# Altium project LimeKEY-RPCM_1v1.PrjPcb (part 11 of 12)
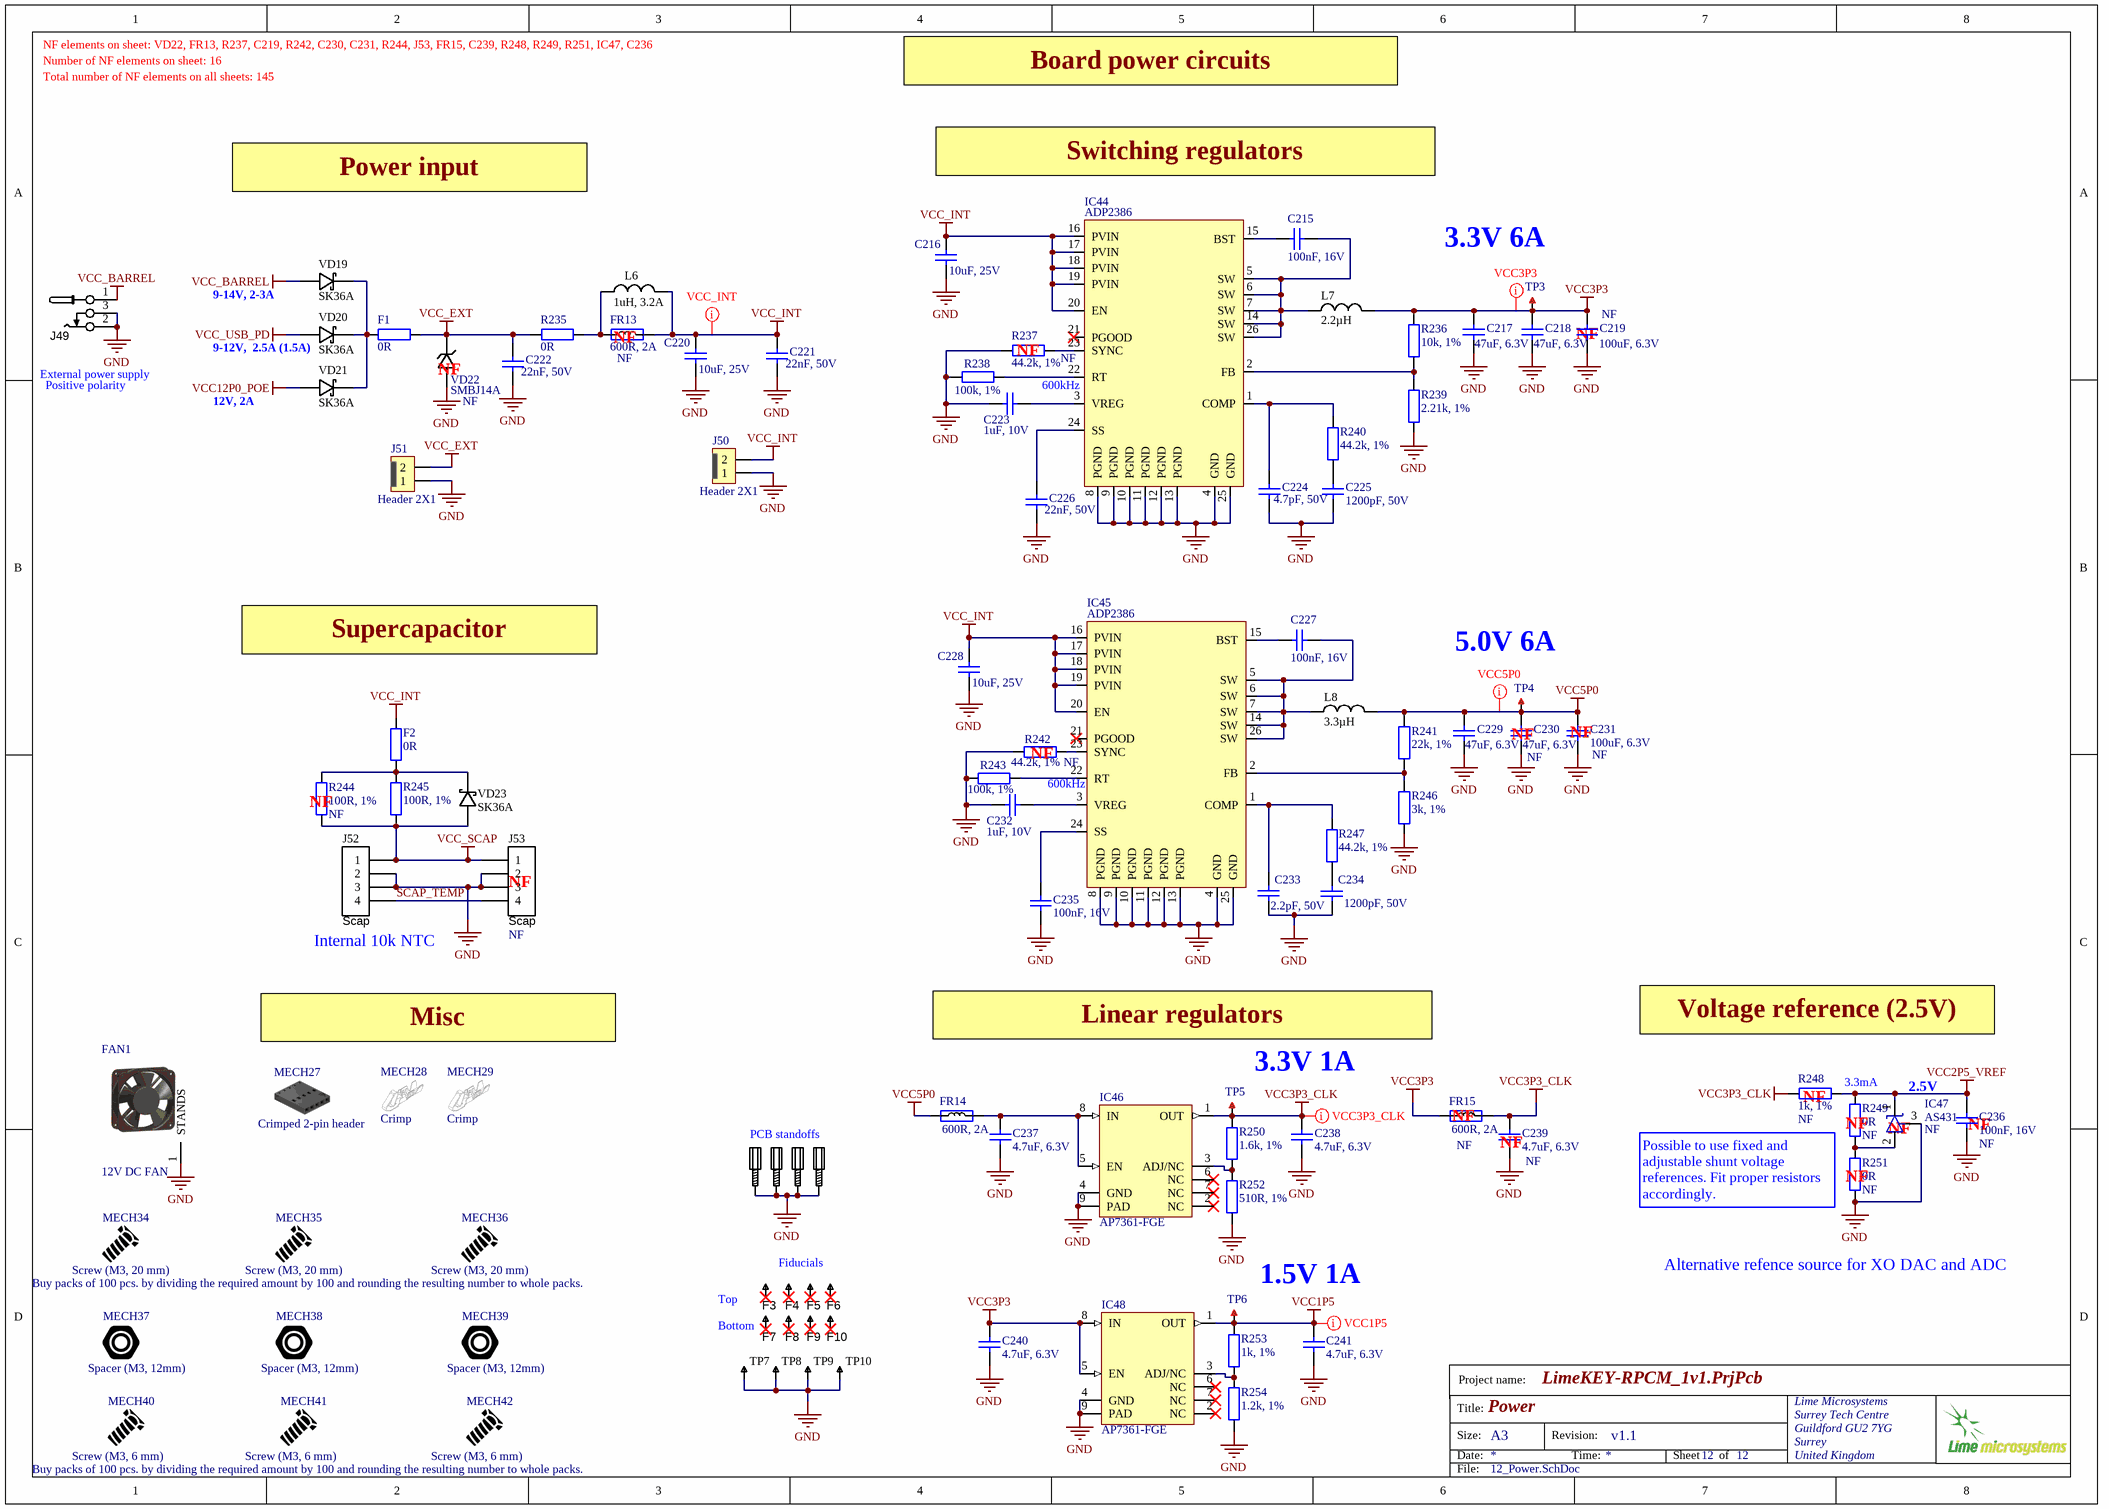
[diagram p111: 12_Power.SchDoc]

## Sheet 12_Power.SchDoc: Power (continued)

### Library data of the parts
C215 C227 C235 = Cap_0402: Manufacturer: Murata Electronics; Manufacturer Part Number 1: GRM155R71C104KA88D; Part Description: 0.10µF ±10% 16V Ceramic Capacitor X7R 0402 (1005 Metric); Tolerance: 10 %; Type: General Purpose MLCC; Capacitance: 0.1 uF; Case Length: 1 mm; Dielectric: X7R; Case Height: 0.5 mm; Temperature Coefficient / Code: +/- 15 %; Value: 100nF, 16V; Supplier 1: Mouser; Supplier Part Number 1: 81-GRM155R71C104KA88; Case Code - in: 0402; RoHS: RoHS Compliant; Operating Temperature Range: - 55 C to + 125 C; Series: GRM; Termination Style: SMD/SMT; Package / Case: 0402 (1005 metric); Voltage Rating DC: 16 V; Maximum Operating Temperature: + 125 C; Case Code - mm: 1005; Minimum Operating Temperature: - 55 C; Product Category: Low & Medium Capacitance SMD Ceramic Chip Capacitors; Packaging: Reel; Product: General Type MLCCs; Category: Multilayer Ceramic Capacitors MLCC - SMD/SMT; Brand: Murata Electronics; Case Width: 0.5 mm; RoHS - Mouser: Y; Standard Pack Qty: 10000; Minimum Order Quantity: 1; Reeling: True; Manufacturer Part Number: GRM155R71C104KA88D
C216 C220 C228 = Cap_0603: Manufacturer: Murata Electronics North America; Manufacturer Part Number: GRM188R61E106MA73D; Part Description: 10µF ±20% 25V X5R Ceramic Capacitor -55°C ~ 85°C Surface Mount, MLCC 0603 (1608 Metric) 0.063" L x 0.031" W (1.60mm x 0.80mm); Capacitance: 10µF; Tolerance: ±20%; Temperature Coefficient: X5R; Supplier 1: Digi-Key; Supplier Part Number 1: 490-7202-2-ND; Category: Capacitors; RoHS: RoHS Compliant; Packaging: Tape & Reel (TR); Voltage - Rated: 25V; Mounting Type: Surface Mount, MLCC; Operating Temperature: -55°C ~ 85°C; Applications: General Purpose; Ratings: -; Package / Case: 0603 (1608 Metric); Size / Dimension: 0.063" L x 0.031" W (1.60mm x 0.80mm); Height - Seated (Max): -; Thickness (Max): 0.031" (0.80mm); Lead Spacing: -; Features: -; Lead Style: -; value: 10uF, 25V; Manufacturer Part Number 1: GRM188R61E106MA73D
C217 C218 C229 C230 = Cap_1206: Manufacturer: Samsung Electro-Mechanics; Manufacturer Part Number: CL31A476MQHNNNE; Part Description: 47µF ±20% 6.3V Ceramic Capacitor X5R 1206 (3216 Metric); Notification: Current market demand for these product types have resulted in fluctuating and extending lead times. Lead times may differ.; Temperature Coefficient: X5R; Tolerance: ±20%; Thickness (Max): 0.071" (1.80mm); Height - Seated (Max): -; Operating Temperature: -55°C ~ 85°C; Lead Style: -; Package / Case: 1206 (3216 Metric); Size / Dimension: 0.126" L x 0.063" W (3.20mm x 1.60mm); Applications: General Purpose; Ratings: -; Mounting Type: Surface Mount, MLCC; Voltage - Rated: 6.3V; Lead Spacing: -; Features: -; Supplier Part Number 1: 1276-1167-1-ND; RoHS: RoHS Compliant; Category: Capacitors; Supplier 1: Digi-Key; Packaging: Cut Tape (CT); Part Status: Active; Value: 47uF, 6.3V; Manufacturer Part Number 1: CL31A476MQHNNNE
C219 C231 = Cap_1206: Manufacturer: MURATA; Manufacturer Part Number 1: GRM31CR60J107ME39L.; Part Description: SMD Multilayer Ceramic Capacitor, 1206 [3216 Metric], 100 µF, 6.3 V, ± 20%, X5R, GRM Series; Capacitance Tolerance: ± 20%; Ceramic Capacitor Case: 1206 [3216 Metric]; Voltage Rating: 6.3; value: 100uF, 6.3V; Supplier Part Number 1: 1735535; Supplier 1: Farnell
C221 C222 C226 = Cap_0402: Manufacturer: Kemet; Manufacturer Part Number 1: C0402C223K5RACTU; Part Description: 0.022µF ±10% 50V X7R Ceramic Capacitor -55°C ~ 125°C Surface Mount, MLCC 0402 (1005 Metric) 0.039" L x 0.020" W (1.00mm x 0.50mm); Temperature Coefficient: X7R; Tolerance: ±10%; Capacitance: 0.022µF; Value: 22nF, 50V; Supplier 1: Digi-Key; Supplier Part Number 1: 399-7780-1-ND; Ratings: -; Packaging: Cut Tape (CT); Category: Capacitors; Size / Dimension: 0.039" L x 0.020" W (1.00mm x 0.50mm); RoHS: RoHS Compliant; Operating Temperature: -55°C ~ 125°C; Mounting Type: Surface Mount, MLCC; Applications: General Purpose; Voltage - Rated: 50V; Thickness (Max): 0.022" (0.55mm); Features: -; Height - Seated (Max): -; Lead Style: -; Package / Case: 0402 (1005 Metric); Lead Spacing: -
C223 C232 = Cap_0402: Manufacturer Part Number 1: CC0402MRX5R6BB105; Manufacturer: Yageo; Part Description: 1µF 10V Ceramic Capacitor X5R 0402 (1005 Metric) 0.039" L x 0.020" W (1.00mm x 0.50mm); Voltage Rating: 10; Capacitance Tolerance: ± 10%; Product Range: TDK - C Series; Ceramic Capacitor Case: 0402 [1005 Metric]; Capacitance: 1; Dielectric Characteristic: X6; Value: 1uF, 10V; Supplier 1: Digi-Key; Supplier Part Number 1: 311-1732-1-ND; MSL: -; RoHS: YES
C224 = Cap_0402: Manufacturer Part Number 1: GRM1555C1H4R7CA01D; Part Description: 4.7pF ±0.25pF 50V C0G, NP0 Ceramic Capacitor -55°C ~ 125°C Surface Mount, MLCC 0402 (1005 Metric) 0.039" L x 0.020" W (1.00mm x 0.50mm); Manufacturer: Murata Electronics North America; Capacitance Tolerance: ± 0.25; Voltage Rating: 50; Dielectric Characteristic: C0G / NP0; Ceramic Capacitor Case: 0402 [1005 Metric]; Capacitance: 4.7; SVHC: No SVHC (15-Jun-2015; Product Range: GRM Series; Value: 4.7pF, 50V; Supplier 1: Farnell; Supplier Part Number 1: 2434644; Operating Temperature Max: 125; Operating Temperature Min: -55; MSL: MSL 1 - Unlimited; RoHS: YES; Packaging: Cut Tape
C225 = Cap_0402: Manufacturer: Kemet; Manufacturer Part Number 1: C0402C122J5GACTU; Part Description: 1200pF ±5% 50V C0G, NP0 Ceramic Capacitor -55°C ~ 125°C Surface Mount, MLCC 0402 (1005 Metric) 0.039" L x 0.020" W (1.00mm x 0.50mm); Temperature Coefficient: C0G, NP0; Tolerance: ±5%; Value: 1200pF, 50V; Supplier 1: Digi-Key; Supplier Part Number 1: 399-7334-1-ND; Thickness (Max): 0.022" (0.55mm); Capacitance: 1200pF; Lead Spacing: -; Mounting Type: Surface Mount, MLCC; Package / Case: 0402 (1005 Metric); Category: Capacitors; Size / Dimension: 0.039" L x 0.020" W (1.00mm x 0.50mm); Voltage - Rated: 50V; Lead Style: -; Ratings: -; Features: -; Packaging: Cut Tape (CT); RoHS: RoHS Compliant; Operating Temperature: -55°C ~ 125°C; Applications: General Purpose; Height - Seated (Max): -
C233 = Cap_0402: Manufacturer Part Number 1: CL05C2R2CB5NNNC; Manufacturer: Samsung Electro-Mechanics America, Inc.; Part Description: 2.2pF ±0.25pF 50V Ceramic Capacitor C0G, NP0 0402 (1005 Metric); Temperature Coefficient: C0G, NP0; Tolerance: ±0.25pF; Value: 2.2pF, 50V; Lead Spacing: -; Applications: General Purpose; Supplier 1: Digi-Key; Thickness (Max): 0.022" (0.55mm); Operating Temperature: -55°C ~ 125°C; Size / Dimension: 0.039" L x 0.020" W (1.00mm x 0.50mm); Mounting Type: Surface Mount, MLCC; Features: -; Voltage - Rated: 50V; Capacitance: 2.2pF; Lead Style: -; Supplier Part Number 1: 1276-1271-1-ND; Height - Seated (Max): -; Package / Case: 0402 (1005 Metric); Category: Capacitors; Packaging: Cut Tape (CT); Ratings: -; RoHS: RoHS Compliant
C234 = Cap_0402: Manufacturer: Kemet; Manufacturer Part Number 1: C0402C122J5GACTU; Part Description: 1200pF ±5% 50V Ceramic Capacitor C0G, NP0 0402 (1005 Metric); Temperature Coefficient: C0G, NP0; Tolerance: ±5%; Value: 1200pF, 50V; Supplier 1: Digi-Key; Supplier Part Number 1: 399-7334-1-ND; Thickness (Max): 0.022" (0.55mm); Capacitance: 1200pF; Lead Spacing: -; Mounting Type: Surface Mount, MLCC; Package / Case: 0402 (1005 Metric); Category: Capacitors; Size / Dimension: 0.039" L x 0.020" W (1.00mm x 0.50mm); Voltage - Rated: 50V; Lead Style: -; Ratings: -; Features: -; Packaging: Cut Tape (CT); RoHS: RoHS Compliant; Operating Temperature: -55°C ~ 125°C; Applications: General Purpose; Height - Seated (Max): -
C236 = Cap_0603: Manufacturer Part Number 1: GRM155R71C104KA88D; Part Description: 0.10µF ±10% 16V X7R Ceramic Capacitor -55°C ~ 125°C Surface Mount, MLCC 0402 (1005 Metric) 0.039" L x 0.020" W (1.00mm x 0.50mm); Brand: Murata Electronics; Tolerance: 10 %; Type: General Purpose MLCC; Capacitance: 0.1 uF; Temperature Coefficient / Code: +/- 15 %; Case Height: 0.5 mm; Case Length: 1 mm; Dielectric: X7R; Supplier 1: Mouser; Supplier Part Number 1: 81-GRM155R71C104KA88; Case Code - in: 0402; Manufacturer: Murata Electronics; Category: Multilayer Ceramic Capacitors MLCC - SMD/SMT; Voltage Rating DC: 16 V; Value: 100nF, 16V; Case Code - mm: 1005; Case Width: 0.5 mm; Maximum Operating Temperature: + 125 C; Minimum Operating Temperature: - 55 C; Minimum Order Quantity: 1; Operating Temperature Range: - 55 C to + 125 C; Package / Case: 0402 (1005 metric); Packaging: Reel; Product: General Type MLCCs; Product Category: Low & Medium Capacitance SMD Ceramic Chip Capacitors; Reeling: True; RoHS - Mouser: Y; RoHS: RoHS Compliant; Series: GRM; Standard Pack Qty: 10000; Termination Style: SMD/SMT
C237-C241 = Cap_0402: Manufacturer: Murata Electronics North America; Manufacturer Part Number 1: GRM155R60J475ME87D; Part Description: 4.7µF ±20% 6.3V X5R Ceramic Capacitor -55°C ~ 85°C Surface Mount, MLCC 0402 (1005 Metric) 0.039" L x 0.020" W (1.00mm x 0.50mm); Tolerance: ±20%; Capacitance: 4.7µF; Temperature Coefficient: X5R; Lead Style: -; Ratings: -; Height - Seated (Max): -; Thickness (Max): 0.022" (0.55mm); Voltage - Rated: 6.3V; Packaging: Cut Tape (CT); Lead Spacing: -; Category: Capacitors; Supplier Part Number 1: 490-5408-1-ND; Applications: General Purpose; Operating Temperature: -55°C ~ 85°C; Mounting Type: Surface Mount, MLCC; Features: Derating Recommended; RoHS: RoHS Compliant; Supplier 1: Digi-Key; Package / Case: 0402 (1005 Metric); Size / Dimension: 0.039" L x 0.020" W (1.00mm x 0.50mm); Value: 4.7uF, 6.3V
F1 F2 R235 = Res_0402: Manufacturer Part Number 1: CRCW08050000Z0EA; Manufacturer: Vishay Dale; Part Description: RES SMD 0.0 OHM JUMPER 1/8W 0805; Power (Watts): 0.125W, 1/8W; Resistance (Ohms): 0.0; Tolerance: Jumper; Value: 0R; Supplier 1: Digi-Key; Supplier Part Number 1: 541-0.0ATR-ND; Package / Case: 0805 (2012 Metric); Height: 0.020" (0.50mm); Packaging: Tape & Reel (TR); Operating Temperature: -55°C ~ 155°C; Temperature Coefficient: -; RoHS: RoHS Compliant; Size / Dimension: 0.079" L x 0.049" W (2.00mm x 1.25mm); Supplier Device Package: 0805 (2012 Metric); Number of Terminations: 2; Category: Resistors; Features: Automotive AEC-Q200; Composition: Thick Film
FAN1 = 12V_DC_FAN: Part Description: Fan Tubeaxial 12VDC Square - 80mm L x 80mm H Vapo-Bearing™ 37.0 CFM (1.04m³/min) 2 Wire Leads; Manufacturer: Sunon; Manufacturer Part Number 1: ME80151V1-000U-A99; Airflow: 37CFM; Noise: 34.7dBA; Max Power Dissipation: 1.96W; RPM: 3000RPM; Bearing Type: Vapo-Bearing; Current Rating: 163mA; Approvals: UL,CE,TUV; Supplier 1: Digi-Key; Supplier Part Number 1: 259-1649-ND; Stock 1: 1611; Pricing 1: 1=6,90000, 10=6,66700, 25=6,47400, 50=6,08860, 100=5,47200, 250=5,39488, 500=5,04808 (USD); RoHS: Yes; Case/Package: Axial; Housing Material: Thermoplastic; Weight: 0.15lb; Min Operating Temperature: 14°C; Max Operating Temperature: 158°C; Termination: 2 Wire Leads; Package Quantity: 30; Width: 15mm; Flammability Rating: UL94 V-0; ComponentLink1URL: https://datasheet.ciiva.com/18514/me8015-u-18514537.pdf?src-supplier=Digi-Key; ComponentLink1Description: https://datasheet.ciiva.com/18514/me8015-u-18514537.pdf?src-supplier=Digi-Key
FR13 = Ferrite: Manufacturer Part Number 1: MPZ2012S601AT000; Manufacturer: TDK Corporation; Part Description: FERRITE BEAD 600 OHM 0805 1LN; DC Resistance (DCR): 100 mOhm Max; Filter Type: Differential Mode - Single; Impedance @ Frequency: 600 Ohm @ 100MHz; Supplier 1: Digi-Key; Supplier Part Number 1: 445-2206-2-ND; Value: 600R, 2A; Category: Filters; Current Rating: 2A; Height (Max): 0.041" (1.05mm); Mounting Type: Surface Mount; Package / Case: 0805 (2012 Metric); Packaging: Tape & Reel (TR); RoHS: RoHS Compliant; Size / Dimension: 0.079" L x 0.049" W (2.00mm x 1.25mm)
FR14 FR15 = Ferrite: Manufacturer Part Number 1: MPZ2012S601AT000; Manufacturer: TDK Corporation; Part Description: FERRITE BEAD 600 OHM 0805 1LN; Filter Type: Differential Mode - Single; Impedance @ Frequency: 600 Ohm @ 100MHz; DC Resistance (DCR): 100 mOhm Max; Supplier 1: Digi-Key; Supplier Part Number 1: 445-2206-2-ND; Mounting Type: Surface Mount; RoHS: RoHS Compliant; Height (Max): 0.041" (1.05mm); Packaging: Tape & Reel (TR); Category: Filters; Current Rating: 2A; Package / Case: 0805 (2012 Metric); Size / Dimension: 0.079" L x 0.049" W (2.00mm x 1.25mm)
IC44 = ADP2386: Manufacturer Part Number: ADP2386ACPZN-R7; Manufacturer: Analog Devices Inc.; Part Description: IC REG BUCK ADJ 6A SYNC 24LFCSP; Function: Step-Down; Voltage - Output (Max): 18V; Synchronous Rectifier: Yes; Output Configuration: Positive; Frequency - Switching: 200kHz ~ 1.4MHz; Number of Outputs: 1; Output Type: Adjustable; Topology: Buck; Voltage - Input (Min): 4.5V; Voltage - Output (Min/Fixed): 0.6V; Voltage - Input (Max): 20V; Current - Output: 6A; Supplier 1: Digi-Key; Packaging: Digi-Reel®; RoHS: RoHS Compliant; Package / Case: 24-WFQFN Exposed Pad, CSP; Operating Temperature: -40°C ~ 125°C (TJ); Supplier Device Package 1: 24-LFCSP-WQ (4x4); Mounting Type: Surface Mount; Category: Integrated Circuits (ICs); Supplier Part Number 1: ADP2386ACPZN-R7DKR-ND; Manufacturer Part Number 1: ADP2386ACPZN-R7
IC45 = ADP2386: Manufacturer: Analog Devices Inc.; Part Description: Buck Switching Regulator IC Positive Adjustable 0.6V 1 Output 6A 24-WFQFN Exposed Pad, CSP; Manufacturer Part Number 1: ADP2386ACPZN-R7; Function: Step-Down; Voltage - Output (Max): 18V; Synchronous Rectifier: Yes; Output Configuration: Positive; Frequency - Switching: 200kHz ~ 1.4MHz; Number of Outputs: 1; Output Type: Adjustable; Topology: Buck; Voltage - Input (Min): 4.5V; Voltage - Output (Min/Fixed): 0.6V; Voltage - Input (Max): 20V; Current - Output: 6A; Supplier 1: Digi-Key; Packaging: Digi-Reel®; RoHS: RoHS Compliant; Package / Case: 24-WFQFN Exposed Pad, CSP; Operating Temperature: -40°C ~ 125°C (TJ); Supplier Device Package: 24-LFCSP-WQ (4x4); Mounting Type: Surface Mount; Category: Integrated Circuits (ICs); Supplier Part Number 1: ADP2386ACPZN-R7DKR-ND
IC46 IC48 = AP7361: Manufacturer Part Number 1: AP7361-FGE-7; Manufacturer: Diodes Incorporated; Part Description: IC REG LDO ADJ 1A 8DFN; Regulator Topology: Positive Adjustable; Current - Output: 1A; Current - Limit (Min): 1.1A; Voltage - Dropout (Typical): 0.5V @ 1A; Voltage - Output: 0.8 V ~ 5.5 V; Number of Regulators: 1; Voltage - Input: 2.2 V ~ 6 V; Supplier 1: Digi-Key; Supplier Part Number 1: AP7361-FGE-7DICT-ND; RoHS: RoHS Compliant; Supplier Device Package: U-DFN3030-8; Mounting Type: Surface Mount; Category: Integrated Circuits (ICs); Packaging: Cut Tape (CT); Package / Case: 8-UDFN Exposed Pad; Operating Temperature: -40°C ~ 85°C
IC47 = VOLTAGE_REFERENCE_UNIVERSAL: Manufacturer: Diodes; Manufacturer Part Number 1: AS431ANTR-G1; Part Description: Shunt Voltage Reference IC Adjustable 2.5V 36 VV ±0.5% 100 mA SOT-23-3; Cathode Current: 1mA; Max Input Voltage: 36V; Max Output Current: 100mA; Min Output Voltage: 2.5V; Output Type: Adjustable; Reference Type: Shunt; Temperature Coefficient: 20ppm/°C; Tolerance: 0.5%; ComponentLink1URL: https://datasheet.ciiva.com/1177/1643148-1177233.pdf?src-supplier=Avnet; ComponentLink1Description: https://datasheet.ciiva.com/1177/1643148-1177233.pdf?src-supplier=Avnet; Case/Package: TO-236-3; ComponentLink2Description: https://datasheet.ciiva.com/30002/as431-30002029.pdf?src-supplier=Avnet; ComponentLink2URL: https://datasheet.ciiva.com/30002/as431-30002029.pdf?src-supplier=Avnet; ComponentLink3Description: https://datasheet.ciiva.com/29572/as431-29572149.pdf?src-supplier=Digi-Key; ComponentLink3URL: https://datasheet.ciiva.com/29572/as431-29572149.pdf?src-supplier=Digi-Key; ComponentLink4Description: https://datasheet.ciiva.com/29572/as431-29572150.pdf?src-supplier=Digi-Key; ComponentLink4URL: https://datasheet.ciiva.com/29572/as431-29572150.pdf?src-supplier=Digi-Key; Max Operating Temperature: 125°C; Max Output Voltage: 36V; Min Operating Temperature: -40°C; Mount: Surface Mount; Number of Pins: 3; Output Current: 100mA; Output Voltage: 36V; Package Quantity: 3000; Packaging: Tape and Reel; Pricing 1: 1=0,36000, 10=0,27000, 25=0,23600, 100=0,15270, 250=0,12640, 500=0,10112, 1000=0,07753 (USD); Radiation Hardening: No; RoHS: Yes; RoHS Compliant: Yes; Stock 1: 792556; Supplier 1: Digi-Key; Supplier Part Number 1: AS431ANTR-G1DICT-ND
J49 = CONN_PWR_JACK_2.1x5.5mm: Power Connector, THT, 2.1mm ID, 5.5mm OD; Part Description: Power Barrel Connector Jack 2.10mm ID (0.083"), 5.50mm OD (0.217") Through Hole, Right Angle; Manufacturer: CUI; Manufacturer Part Number 1: PJ-002A; Gender: Male; Shielding: Unshielded; Current Rating: 2.5A; Connector Type: Jack; Voltage Rating: 24V; Insulation Resistance: 50MR; Number of Conductors: 2; ComponentLink1URL: https://www.verical.com/server-webapp/html/getDatasheet?partID=110865; ComponentLink1Description: https://www.verical.com/server-webapp/html/getDatasheet?partID=110865; ComponentLink2URL: http://www.switchcraft.com/Documents/Jack_Schematics.pdf; ComponentLink2Description: http://www.switchcraft.com/Documents/Jack_Schematics.pdf; Supplier 1: Digi-Key; Supplier Part Number 1: CP-002A-ND; RoHS: Yes; Stock 1: 181439; Pricing 1: 1 = 0,60000, 10 = 0,55800, 25 = 0,50240, 50 = 0,44640, 100 = 0,42780, 250 = 0,39060, 500 = 0,37200, 1000 = 0,30690, 2500 = 0,27900 (USD); Mount: Through Hole; Contact Material: Copper,Copper Alloy; Contact Plating: Nickel,Tin; Housing Color: Black; Housing Material: Thermoplastic; Color: Black; Min Operating Temperature: -25°C; Max Operating Temperature: 85°C; Termination: Through Hole; Packaging: Bulk; Package Quantity: 500; Contact Gender: Male; Orientation: Horizontal; Diameter: 2.1mm; Lead Free: Lead Free; Flammability Rating: UL94 V-0
J50 J51 = Header 2X1 LOCK: Manufacturer 1: Molex; Part Description: Connector Header Through Hole 2 position 0.100" (2.54mm); Supplier 1: Digi-Key; Supplier Part Number 1: WM19460-ND; Manufacturer Part Number: 22-11-2026; Stock 1: 0; RoHS: Yes; ComponentLink1URL: https://datasheet.ciiva.com/5156/022045042-sd-206842-5156139.pdf?src-supplier=Mouser; ComponentLink1Description: https://datasheet.ciiva.com/5156/022045042-sd-206842-5156139.pdf?src-supplier=Mouser; ComponentLink2URL: https://datasheet.ciiva.com/30212/022232051-sd-30212109.pdf?src-supplier=Onlinecomponents.com; ComponentLink2Description: https://datasheet.ciiva.com/30212/022232051-sd-30212109.pdf?src-supplier=Onlinecomponents.com; Manufacturer: Molex; Manufacturer Part Number 1: 22-11-2026
J52 = Header4P: Header, 4-pin; Manufacturer 1: Molex; Manufacturer Part Number: 0874370443; Part Description: Connector Header Surface Mount 4 position 0.059" (1.50mm); ComponentLink1URL: http://katalog.we-online.de/em/datasheet/6130xx11121.pdf; ComponentLink1Description: http://katalog.we-online.de/em/datasheet/6130xx11121.pdf; Supplier 1: Digi-Key; Supplier Part Number 1: WM7664CT-ND; Stock 1: 30818; Pricing 1: 1=0,72000, 10=0,61200, 100=0,47560 (USD); RoHS: Yes; ComponentLink2URL: https://datasheet.ciiva.com/6813/874370443-sd-6813714.pdf?src-supplier=Digi-Key; ComponentLink2Description: https://datasheet.ciiva.com/6813/874370443-sd-6813714.pdf?src-supplier=Digi-Key; ComponentLink3URL: https://datasheet.ciiva.com/3935/197970874370443-pcb-headers-3935892.pdf?src-supplier=Arrow+Electronics; ComponentLink3Description: https://datasheet.ciiva.com/3935/197970874370443-pcb-headers-3935892.pdf?src-supplier=Arrow+Electronics; ComponentLink4URL: https://datasheet.ciiva.com/6813/874370443-sd-6813717.pdf?src-supplier=Digi-Key; ComponentLink4Description: https://datasheet.ciiva.com/6813/874370443-sd-6813717.pdf?src-supplier=Digi-Key; ComponentLink5URL: https://datasheet.ciiva.com/6813/874370443-sd-6813721.pdf?src-supplier=Digi-Key; ComponentLink5Description: https://datasheet.ciiva.com/6813/874370443-sd-6813721.pdf?src-supplier=Digi-Key; Manufacturer: Molex; Manufacturer Part Number 1: 0874370443
J53 = Header4P: Header, 4-pin; Part Description: 4 Positions Header Connector 0.100" (2.54mm) Through Hole Gold; Manufacturer: Wurth Electronics Inc.; Manufacturer Part Number 1: 61300411121; Pitch - Mating: 0.100" (2.54mm); Number of Positions: 4; Number of Positions Loaded: All; Style: Board to Board or Cable; Shrouding: Unshrouded; Contact Length - Mating: 0.236" (6.00mm); Contact Length - Post: 0.118" (3.00mm); Overall Contact Length: 0.454" (11.54mm); Material Flammability Rating: UL94 V-0; Current Rating: 3A; Voltage Rating: 250V; Supplier 1: Digi-Key; Supplier Part Number 1: 732-5317-ND; RoHS: RoHS Compliant; Category: Connectors, Interconnects; Stock 1: 25204; Pricing 1: 1=0.18, 10=0.153, 25=0.1272, 50=0.106, 100=0.096, 1000=0.088 (USD); Packaging: Bulk; Part Status: Active; Connector Type: Header; Contact Type: Male Pin; Number of Rows: 1; Row Spacing - Mating: -; Mounting Type: Through Hole; Termination: Solder; Fastening Type: Push-Pull; Insulation Height: 0.100" (2.54mm); Contact Shape: Square; Contact Finish - Mating: Gold; Contact Finish Thickness - Mating: -; Contact Finish - Post: -; Contact Material: Copper Alloy; Insulation Material: Polybutylene Terephthalate (PBT); Features: -; Operating Temperature: -40°C ~ 125°C; Ingress Protection: -; Insulation Color: Black; Mated Stacking Heights: -; Contact Finish Thickness - Post: -; Applications: -; ComponentLink1URL: http://katalog.we-online.de/em/datasheet/6130xx11121.pdf; ComponentLink1Description: http://katalog.we-online.de/em/datasheet/6130xx11121.pdf
L6 = Inductor_0603: Manufacturer: Taiyo Yuden; Manufacturer Part Number 1: NRS4018T1R0NDGJ; Part Description: 1 µH Shielded Drum Core, Wirewound Inductor 3.2 A 32.4mOhm Max Nonstandard; Core Material: Ferrite; Self Resonant Frequency: 90MHz; Tolerance: 30%; Saturation Current: 4A; Shielding: Shielded; DC Resistance (DCR): 32.4mR; Test Frequency: 100kHz; ComponentLink1URL: https://www.yuden.co.jp/productdata/catalog/en/wound04_e.pdf; ComponentLink1Description: https://www.yuden.co.jp/productdata/catalog/en/wound04_e.pdf; ComponentLink2URL: http://uk.rs-online.com/webdocs/10b3/0900766b810b3cd2.pdf; ComponentLink2Description: http://uk.rs-online.com/webdocs/10b3/0900766b810b3cd2.pdf; Supplier 1: Digi-Key; Supplier Part Number 1: 587-2888-1-ND; Stock 1: 277625; Pricing 1: 1=0,27000, 10=0,23800, 25=0,20840, 50=0,17860, 100=0,16370, 250=0,14884, 500=0,13990, 1000=0,10716 (USD); RoHS: Yes; Mount: Surface Mount; Case/Package: Nonstandard; Number of Pins: 2; Min Operating Temperature: -25°C; Max Operating Temperature: 125°C; Packaging: Cut Tape; Inductance: 1uH; Package Quantity: 3500; Current Rating: 3.2A; Inductance Tolerance: 30%; Resistor Type: Wirewound; Max DC Current: 4A; Termination: SMD/SMT; RMS Current (Irms): 3.2A; Series: NRS; Length: 4mm; Width: 0.157inch; Height: 1.8mm; Height - Seated (Max): 0.071inch; Depth: 4.2mm; Lead Pitch: 2.8mm; Radiation Hardening: No; Lead Free: Lead Free; Halogen Free: Halogen Free; REACH SVHC: Unknown; RoHS Compliant: Yes; ComponentLink3URL: https://datasheet.ciiva.com/1043/nrs4018t1r0ndgj-ss-1043587.pdf?src-supplier=Digi-Key; ComponentLink3Description: https://datasheet.ciiva.com/1043/nrs4018t1r0ndgj-ss-1043587.pdf?src-supplier=Digi-Key; ComponentLink4URL: https://datasheet.ciiva.com/25607/0900766b810b3cd2-25607942.pdf?src-supplier=RSComponents; ComponentLink4Description: https://datasheet.ciiva.com/25607/0900766b810b3cd2-25607942.pdf?src-supplier=RSComponents; ComponentLink5URL: https://datasheet.ciiva.com/8504/nrs4018t1r0ndgj-ss-8504305.pdf?src-supplier=Avnet; ComponentLink5Description: https://datasheet.ciiva.com/8504/nrs4018t1r0ndgj-ss-8504305.pdf?src-supplier=Avnet; Value: 1uH, 3.2A
L7 = Inductor_0603: Manufacturer Part Number 1: IHLP4040DZER2R2M01; Manufacturer: Vishay Dale; Part Description: 2.2µH Shielded Molded Inductor 12A 9 mOhm Max Nonstandard; Type: Molded; Current Rating: 12A; Frequency - Test: 100kHz; Current - Saturation: 25.6A; DC Resistance (DCR): 9 mOhm Max; Shielding: Shielded; Tolerance: ±20%; Supplier 1: Digi-Key; Supplier Part Number 1: 541-1299-1-ND; Package / Case: Nonstandard; Material - Core: -; Size / Dimension: 0.430" L x 0.405" W (10.92mm x 10.30mm); Supplier Device Package: -; Inductance: 2.2µH; Frequency - Self Resonant: -; Packaging: Cut Tape (CT); Height - Seated (Max): 0.158" (4.00mm); Category: Inductors, Coils, Chokes; RoHS: RoHS Compliant; Mounting Type: Surface Mount; Operating Temperature: -55°C ~ 125°C; Q @ Freq: -; value: 2.2µH
L8 = Inductor_0603: Manufacturer: Vishay Dale; Manufacturer Part Number 1: IHLP4040DZER3R3M01; Part Description: 3.3µH Shielded Molded Inductor 10A 14.4 mOhm Max Nonstandard; DC Resistance (DCR): 14.4 mOhm Max; Shielding: Shielded; Type: Molded; Current Rating: 10A; Frequency - Test: 100kHz; Current - Saturation: 18.6A; Tolerance: ±20%; value: 3.3µH; Package / Case: Nonstandard; Q @ Freq: -; Supplier 1: Digi-Key; Packaging: Cut Tape (CT); Inductance: 3.3µH; Material - Core: -; Category: Inductors, Coils, Chokes; Frequency - Self Resonant: -; Height - Seated (Max): 0.158" (4.00mm); Supplier Device Package: -; RoHS: RoHS Compliant; Size / Dimension: 0.430" L x 0.405" W (10.92mm x 10.30mm); Mounting Type: Surface Mount; Operating Temperature: -55°C ~ 125°C; Supplier Part Number 1: 541-1298-1-ND
MECH27 = Universal_crimped_header: Part Description: 2 Rectangular Connectors - Housings Receptacle White 0.100" (2.54mm); Manufacturer: Molex; Gender: Female; Voltage Rating: 250V; Number of Contacts: 2; Connector Type: Receptacle; Max Current Rating: 4A; Pitch: 2.54mm; Glow Wire Compliant: Non-compliant; Approvals: UL,CSA; Supplier 1: Newark; Supplier Part Number 1: 47T5763; Manufacturer Part Number 1: 22-01-2027; Stock 1: 50789; Pricing 1: 1=0,12200, 10=0,09500, 25=0,08600, 50=0,07700, 100=0,06700, 250=0,06400 (USD); RoHS: Yes; Mount: Free Hanging,Cable; Contact Material: Bronze,Brass; Color: White; Housing Color: White; Housing Material: Nylon; Min Operating Temperature: 0°C; Max Operating Temperature: 75°C; Number of Rows: 1; Package Quantity: 5000; Packaging: Bag; Termination: Crimp; Number of Circuits: 2; Number of Positions: 2; Orientation: Straight; Series: KK® 2695; Contact Type: Non-Gendered; Contact Gender: Female; Fastening Type: Ramp; Length: 5.64mm; Width: 4.82mm; Height: 4.82mm; Depth: 12.7mm; Lead Pitch: 2.54mm; Radiation Hardening: No; Halogen Free: Low Halogen; Flammability Rating: UL94 V-0; RoHS Compliant: Yes; Lead Free: Lead Free
MECH28 MECH29 = Universal_crimp: Part Description: Non-Gendered Contact Tin 22-30 AWG Crimp; Manufacturer: Molex; Body Plating: Tin; Current Rating: 4A; Voltage Rating: 250V; Gender: Female; Connector Type: PCB; Number of Contacts: 1; Contact Resistance: 20mR; Max Current Rating: 2.5A; Resistance: 0.02R; Insulation Resistance: 500GR; Shielding: Unshielded; Wire Gauge (Max): 22AWG; Wire Gauge (Min): 30AWG; Wire/Cable Diameter: 1.57mm; Approvals: UL,CSA; Supplier 1: Mouser; Supplier Part Number 1: 538-08-50-0032; Manufacturer Part Number 1: 08-50-0032; Stock 1: 153072; Pricing 1: 1=0,12000, 10=0,08100, 50=0,08000, 100=0,08000, 1000=0,06400, 10000=0,06400 (USD); RoHS: Yes; Mount: Cable; Contact Material: Brass; Housing Material: Nylon; Terminal Material: Brass; Contact Plating: Tin,Brass; Min Operating Temperature: 0°C; Max Operating Temperature: 75°C; Contact Gender: Female; Packaging: Bulk; Termination: Crimp; Orientation: Straight; Series: KK® 4809; Contact Type: Signal; Voltage Rating (AC): 250V; Package Quantity: 80000; Max Voltage Rating (AC): 250V; Length: 10.4mm; Depth: 2.1mm; Wire/Cable Gauge: 30AWG; Radiation Hardening: No; RoHS Compliant: Yes; Reach SVHC Compliant: Yes; ComponentLink1URL: https://datasheet.ciiva.com/15217/getdatasheetpartid-168593-15217171.pdf?src-supplier=Verical; ComponentLink1Description: https://datasheet.ciiva.com/15217/getdatasheetpartid-168593-15217171.pdf?src-supplier=Verical; ComponentLink2URL: https://datasheet.ciiva.com/19462/736464-19462410.pdf?src-supplier=Jameco; ComponentLink2Description: https://datasheet.ciiva.com/19462/736464-19462410.pdf?src-supplier=Jameco; ComponentLink3URL: https://datasheet.ciiva.com/11723/0900766b80027326-11723308.pdf?src-supplier=Rs; ComponentLink3Description: https://datasheet.ciiva.com/11723/0900766b80027326-11723308.pdf?src-supplier=Rs
MECH30-MECH33 = STANDOFF_M-F_THREADED_M3x8x10mm_HEX_5mm dia: STANDOFF M/F MET 5MM HEX 10MM L; Manufacturer: FIX&FASTEN; Manufacturer Part Number 1: FIX-MAE-5TV; Part Description: PCB distance; polyamide; L:5mm; Colour: natural; Øcutout:3mm; Unit: pcs; SuppliedAmount: 1000; MinAmount: 10; Type of spacer: PCB distance; Panel cutout diameter: 3mm; Spanner size: 5.5mm; Internal thread: M3; Thread pitch: 0,5; Supplier 1: TME; Supplier Part Number 1: FIX-MAE-5TV; Category: Plastic Pegs; Weight: 0.145; Multiples: 10; Material: polyamide; Spacer length: 5mm; Price Type: NET
MECH34 MECH36 = Universal_mech_screw: Part Description: Machine Screw, M3, 20 mm, Steel, Bright Zinc, Flat / Countersunk Head Pozidriv, Pack of 100; Manufacturer: TR Fastenings; Manufacturer Part Number 1: M3 20 KRSTMC Z100; Assembly Info: Buy packs of 100 pcs. by dividing the required amount by 100 and rounding the resulting number to whole packs.; Supplier 1: Farnell; Supplier Part Number 1: 1420401; Stock 1: 226; Pricing 1: 1=2,66000, 30=1,88000, 60=1,77000 (EUR); RoHS: No; ComponentLink1URL: http://www.farnell.com/datasheets/2644719.pdf?src-supplier=Farnell; ComponentLink1Description: http://www.farnell.com/datasheets/2644719.pdf?src-supplier=Farnell
MECH35 = Universal_mech_screw: Part Description: Machine Screw, M3, 20 mm, Steel, Bright Zinc, Flat / Countersunk Head Pozidriv, Pack of 100; Manufacturer: TR Fastenings; Manufacturer Part Number 1: M3 20 KRSTMC Z100; Supplier 1: Farnell; Supplier Part Number 1: 1420401; Stock 1: 226; Pricing 1: 1=2,66000, 30=1,88000, 60=1,77000 (EUR); RoHS: No; ComponentLink1URL: http://www.farnell.com/datasheets/2644719.pdf?src-supplier=Farnell; ComponentLink1Description: http://www.farnell.com/datasheets/2644719.pdf?src-supplier=Farnell
MECH37-MECH39 = Universal_mech_nut: Part Description: Standoff, Brass, M3, Hex Female, 12 mm, 12 mm; Manufacturer: ETTINGER; Manufacturer Part Number 1: 005.03.123; Supplier 1: Farnell; Supplier Part Number 1: 1466772
MECH40 MECH42 = Universal_mech_screw: Part Description: Machine Screw, M3, 6 mm, Steel 4.8, Bright Zinc, Pan Head Pozidriv; Manufacturer: TR Fastenings; Manufacturer Part Number 1: M3 6 PRSTMC Z100; Assembly Info: Buy packs of 100 pcs. by dividing the required amount by 100 and rounding the resulting number to whole packs.; Supplier 1: Farnell; Supplier Part Number 1: 1419986; Stock 1: 2173; Pricing 1: 1=1,90000, 25=1,35000, 50=1,23000 (EUR); RoHS: No; ComponentLink1URL: http://www.farnell.com/datasheets/2644718.pdf?src-supplier=Farnell; ComponentLink1Description: http://www.farnell.com/datasheets/2644718.pdf?src-supplier=Farnell
MECH41 = Universal_mech_screw: Part Description: Machine Screw, M3, 6 mm, Steel 4.8, Bright Zinc, Pan Head Pozidriv; Manufacturer: TR Fastenings; Manufacturer Part Number 1: M3 6 PRSTMC Z100; Supplier 1: Farnell; Supplier Part Number 1: 1419986; Stock 1: 2173; Pricing 1: 1=1,90000, 25=1,35000, 50=1,23000 (EUR); RoHS: No; ComponentLink1URL: http://www.farnell.com/datasheets/2644718.pdf?src-supplier=Farnell; ComponentLink1Description: http://www.farnell.com/datasheets/2644718.pdf?src-supplier=Farnell
R236 = Res_0402: Manufacturer: Yageo; Manufacturer Part Number 1: RC0402FR-0710KL; Part Description: RES SMD 10K OHM 1% 1/16W 0402; Temperature Coefficient: ±100ppm/°C; Power (Watts): 0.063W, 1/16W; Value: 10k, 1%; Supplier 1: Digi-Key; Supplier Part Number 1: 311-10.0KLRTR-ND; Resistance (Ohms): 10k; Packaging: Tape & Reel (TR); RoHS: RoHS Compliant; Package / Case: 0402 (1005 Metric); Tolerance: ±1%; Operating Temperature: -55°C ~ 155°C; Size / Dimension: 0.039" L x 0.020" W (1.00mm x 0.50mm); Number of Terminations: 2; Category: Resistors; Height: 0.016" (0.40mm); Supplier Device Package: 0402; Features: Moisture Resistant; Composition: Thick Film
R237 R240 R242 R247 = Res_0402: Manufacturer Part Number 1: ERJ-2RKF4422X; Manufacturer: Panasonic Electronic Components; Part Description: RES SMD 44.2K OHM 1% 1/10W 0402; Power (Watts): 0.1W, 1/10W; Temperature Coefficient: ±100ppm/°C; Value: 44.2k, 1%; Supplier 1: Digi-Key; Supplier Part Number 1: P44.2KLCT-ND; Tolerance: ±1%; Supplier Device Package: 0402; Packaging: Cut Tape (CT); Size / Dimension: 0.039" L x 0.020" W (1.00mm x 0.50mm); Features: Automotive AEC-Q200; Package / Case: 0402 (1005 Metric); Height: 0.016" (0.40mm); Operating Temperature: -55°C ~ 155°C; Number of Terminations: 2; Composition: Thick Film; Resistance (Ohms): 44.2k; RoHS: RoHS Compliant; Category: Resistors
R238 R243 = Res_0402: Part Description: 100 kOhms ±1% 0.063W, 1/16W Chip Resistor 0402 (1005 Metric) Thick Film; Manufacturer: Vishay; Manufacturer Part Number 1: CRCW0402100KFKEDC; Power Rating: 62.5mW; Resistance: 100kR; Temperature Coefficient: 100ppm/°C; Value: 100k, 1%; Supplier 1: Digi-Key; Supplier Part Number 1: 541-3960-6-ND; Stock 1: 702107; Pricing 1: 1=0,10000, 10=0,03300, 100=0,01360, 1000=0,00610, 2500=0,00529, 5000=0,00437 (USD); RoHS: Yes; Mount: Surface Mount; Case/Package: SMD/SMT; Contact Plating: Tin; Min Operating Temperature: -55°C; Max Operating Temperature: 155°C; Tolerance: 1%; Resistor Type: Thick Film; Termination: Wraparound; Length: 1mm; Lead Free: Lead Free; RoHS Compliant: Yes; ComponentLink1URL: http://www.vishay.com/docs/28773/crcwce3.pdf?src-supplier=Digi-Key; ComponentLink1Description: http://www.vishay.com/docs/28773/crcwce3.pdf?src-supplier=Digi-Key
R239 = Res_0402: Manufacturer: Stackpole Electronics Inc.; Manufacturer Part Number 1: RMCF0402FT2K21; Part Description: RES SMD 2.21K OHM 1% 1/16W 0402; Power (Watts): 0.063W, 1/16W; Temperature Coefficient: ±100ppm/°C; Value: 2.21k, 1%; Supplier 1: Digi-Key; Supplier Part Number 1: RMCF0402FT2K21CT-ND; Operating Temperature: -55°C ~ 155°C; Height: 0.016" (0.40mm); Tolerance: ±1%; Resistance (Ohms): 2.21k; Features: Automotive AEC-Q200; Package / Case: 0402 (1005 Metric); Packaging: Cut Tape (CT); Composition: Thick Film; Category: Resistors; Supplier Device Package: 0402; Number of Terminations: 2; RoHS: RoHS Compliant; Size / Dimension: 0.039" L x 0.020" W (1.00mm x 0.50mm)
R241 = Res_0402: Manufacturer: Yageo; Part Description: RES SMD 22K OHM 1% 1/16W 0402; Manufacturer Part Number 1: RC0402FR-0722KL; Temperature Coefficient: ±100ppm/°C; Power (Watts): 0.063W, 1/16W; Value: 22k, 1%; Number of Terminations: 2; Operating Temperature: -55°C ~ 155°C; Package / Case: 0402 (1005 Metric); Category: Resistors; Size / Dimension: 0.039" L x 0.020" W (1.00mm x 0.50mm); Height: 0.016" (0.40mm); Supplier 1: Digi-Key; Supplier Part Number 1: 311-22.0KLRCT-ND; RoHS: RoHS Compliant; Features: Moisture Resistant; Packaging: Cut Tape (CT); Composition: Thick Film; Supplier Device Package: 0402; Resistance (Ohms): 22k; Tolerance: ±1%
R244 R245 = Res_0402: Manufacturer: Yageo; Manufacturer Part Number 1: RC0805FR-07100RL; Part Description: 100 Ohms ±1% 0.125W, 1/8W Chip Resistor 0805 (2012 Metric) Moisture Resistant Thick Film; Power Rating: 125mW; Voltage Rating: 150V; Temperature Coefficient: 100ppm/°C; Application(s): HIGH RELIABILITY; Value: 100R, 1%; Supplier 1: Digi-Key; Supplier Part Number 1: 311-100CRCT-ND; Stock 1: 3385227; Pricing 1: 1=0,10000, 10=0,03800, 100=0,01560, 1000=0,00699, 2500=0,00607 (USD); RoHS: Yes; Case/Package: 0805; Number of Pins: 2; Case Code (Imperial): 0805; Case Code (Metric): 2012; Weight: 0.000917oz; Min Operating Temperature: -55°C; Max Operating Temperature: 155°C; Resistance: 100R; Tolerance: 1%; Packaging: Cut Tape; Package Quantity: 5000; Termination: SMD/SMT; Resistor Type: Thick Film; Number of Terminations: 2; Max Power Dissipation: 125mW; Features: Moisture Resistant; Series: RC; Technology: THICK FILM; Voltage Rating (DC): 150V; Type: General Purpose; Length: 2mm; Width: 1.25mm; Height: 0.5mm; Depth: 1.25mm; Lead Pitch: 0.4mm; REACH SVHC: Unknown; Lead Free: Lead Free; RoHS Compliant: Yes; Military Standard: Not
R246 = Res_0402: Manufacturer: Vishay Dale; Part Description: RES SMD 3K OHM 1% 1/16W 0402; Manufacturer Part Number 1: CRCW04023K00FKED; Temperature Coefficient: ±100ppm/°C; Power (Watts): 0.063W, 1/16W; Value: 3k, 1%; Category: Resistors; Tolerance: ±1%; RoHS: RoHS Compliant; Composition: Thick Film; Number of Terminations: 2; Operating Temperature: -55°C ~ 155°C; Supplier Device Package: 0402 (1005 Metric); Supplier Part Number 1: 541-3.00KLCT-ND; Packaging: Cut Tape (CT); Supplier 1: Digi-Key; Package / Case: 0402 (1005 Metric); Features: Automotive AEC-Q200; Resistance (Ohms): 3k; Height: 0.016" (0.40mm); Size / Dimension: 0.039" L x 0.020" W (1.00mm x 0.50mm)
R248 R253 = Res_0402: Manufacturer: Stackpole Electronics Inc; Manufacturer Part Number 1: RMCF0402FT1K00; Part Description: RES SMD 1K OHM 1% 1/16W 0402; Temperature Coefficient: ±100ppm/°C; Power (Watts): 0.063W, 1/16W; Value: 1k, 1%; Supplier 1: Digi-Key; Supplier Part Number 1: RMCF0402FT1K00TR-ND; Package / Case: 0402 (1005 Metric); Supplier Device Package: 0402; Height: 0.016" (0.40mm); Size / Dimension: 0.039" L x 0.020" W (1.00mm x 0.50mm); Number of Terminations: 2; Category: Resistors; Composition: Thick Film; Resistance (Ohms): 1k; Tolerance: ±1%; Operating Temperature: -55°C ~ 155°C; RoHS: RoHS Compliant
  R248: Packaging: Cut Tape (CT); Features: Moisture Resistant
  R253: Packaging: Tape & Reel (TR); Features: -
R249 R251 = Res_0402: Manufacturer Part Number 1: RC0402JR-070RL; Manufacturer: Yageo; Part Description: RES SMD 0.0OHM JUMPER 1/16W 0402; Resistance (Ohms): 0.0; Tolerance: Jumper; Power (Watts): 0.063W, 1/16W; Value: 0R; Supplier 1: Digi-Key; Supplier Part Number 1: 311-0.0JRTR-ND; Category: Resistors; Temperature Coefficient: -; Features: Moisture Resistant; Supplier Device Package: 0402; Height: 0.016" (0.40mm); Package / Case: 0402 (1005 Metric); Operating Temperature: -55°C ~ 155°C; Size / Dimension: 0.039" L x 0.020" W (1.00mm x 0.50mm); Composition: Thick Film; Packaging: Tape & Reel (TR); Number of Terminations: 2; RoHS: RoHS Compliant
R250 = Res_0402: Manufacturer Part Number 1: RC0402FR-071K6L; Manufacturer: Yageo; Part Description: 1.6 kOhms ±1% 0.063W, 1/16W Chip Resistor 0402 (1005 Metric) Moisture Resistant Thick Film; Temperature Coefficient: ±100ppm/°C; Power (Watts): 0.063W, 1/16W; Value: 1.6k, 1%; Tolerance: ±1%; RoHS: RoHS Compliant; Package / Case: 0402 (1005 Metric); Height - Seated (Max): 0.016" (0.40mm); Supplier Device Package: 0402; Failure Rate: -; Composition: Thick Film; Part Status: Active; Size / Dimension: 0.039" L x 0.020" W (1.00mm x 0.50mm); Operating Temperature: -55°C ~ 155°C; Packaging: Cut Tape (CT); Features: Moisture Resistant; Supplier Part Number 1: YAG3045CT-ND; Category: Resistors; Supplier 1: Digi-Key
R252 = Res_0402: Manufacturer Part Number 1: RC0402FR-07510RL; Manufacturer: Yageo; Part Description: 510 Ohms ±1% 0.063W, 1/16W Chip Resistor 0402 (1005 Metric) Moisture Resistant Thick Film; Temperature Coefficient: ±100ppm/°C; Power (Watts): 0.063W, 1/16W; Value: 510R, 1%; Operating Temperature: -55°C ~ 155°C; Part Status: Active; Tolerance: ±1%; Packaging: Cut Tape (CT); Features: Moisture Resistant; Composition: Thick Film; Supplier Device Package: 0402; Failure Rate: -; Package / Case: 0402 (1005 Metric); Height - Seated (Max): 0.016" (0.40mm); Size / Dimension: 0.039" L x 0.020" W (1.00mm x 0.50mm); Supplier 1: Digi-Key; RoHS: RoHS Compliant; Category: Resistors; Supplier Part Number 1: 311-510LRCT-ND
R254 = Res_0402: Manufacturer 1: Yageo; Manufacturer Part Number 1: RC0402FR-071K2L; Part Description: 1.2 kOhms ±1% 0.063W, 1/16W Chip Resistor 0402 (1005 Metric) Moisture Resistant Thick Film; Resistance: 1.2kR; Power Rating: 63mW; Voltage Rating: 50V; Temperature Coefficient: 100ppm/°C; Value: 1.2k, 1%; Supplier 1: Digi-Key; Supplier Part Number 1: 311-1.20KLRCT-ND; Stock 1: 1348237; Pricing 1: 1=0,10000, 10=0,01500, 100=0,00610, 1000=0,00275, 2500=0,00239, 5000=0,00197 (USD); RoHS: Yes; Case/Package: 0402; Case Code (Imperial): 0402; Case Code (Metric): 1005; Size Code: 0402; Min Operating Temperature: -55°C; Max Operating Temperature: 155°C; Tolerance: 1%; Packaging: Tape and Reel; Package Quantity: 1; Termination: SMD/SMT; Resistor Type: Thick Film; Number of Terminations: 2; Max Power Dissipation: 63mW; Features: Moisture Resistant; Series: RC; Construction: Rectangular; Resistance Tolerance: 1%; Technology: THICK FILM; Length: 1mm; Width: 0.02inch; Height: 0.016inch; Depth: 0.5mm; REACH SVHC: Unknown; Military Standard: Not; Lead Free: Lead Free; RoHS Compliant: Yes; ComponentLink1URL: https://datasheet.ciiva.com/11808/0900766b80c66297-11808455.pdf?src-supplier=RSComponents; ComponentLink1Description: https://datasheet.ciiva.com/11808/0900766b80c66297-11808455.pdf?src-supplier=RSComponents; ComponentLink2URL: https://datasheet.ciiva.com/2453/pyu-r-int-thick-7-2453467.pdf?src-supplier=Digi-Key; ComponentLink2Description: https://datasheet.ciiva.com/2453/pyu-r-int-thick-7-2453467.pdf?src-supplier=Digi-Key; ComponentLink3URL: https://datasheet.ciiva.com/2453/pyu-r-int-thick-7-2453468.pdf?src-supplier=Digi-Key; ComponentLink3Description: https://datasheet.ciiva.com/2453/pyu-r-int-thick-7-2453468.pdf?src-supplier=Digi-Key; ComponentLink4URL: https://datasheet.ciiva.com/2453/pyu-r-int-thick-7-2453466.pdf?src-supplier=Digi-Key; ComponentLink4Description: https://datasheet.ciiva.com/2453/pyu-r-int-thick-7-2453466.pdf?src-supplier=Digi-Key; ComponentLink5URL: https://datasheet.ciiva.com/7849/1018594-7849861.pdf?src-supplier=Element14; ComponentLink5Description: https://datasheet.ciiva.com/7849/1018594-7849861.pdf?src-supplier=Element14; ComponentLink6URL: https://datasheet.ciiva.com/7849/1018594-7849862.pdf?src-supplier=Element14; ComponentLink6Description: https://datasheet.ciiva.com/7849/1018594-7849862.pdf?src-supplier=Element14; ComponentLink7URL: https://datasheet.ciiva.com/15189/getdatasheetpartid-323716-15189366.pdf?src-supplier=Verical; ComponentLink7Description: https://datasheet.ciiva.com/15189/getdatasheetpartid-323716-15189366.pdf?src-supplier=Verical; ComponentLink8URL: https://datasheet.ciiva.com/16745/pyu-rc0402-51-rohs-l-6-r-16745005.pdf?src-supplier=Future+Electronics; ComponentLink8Description: https://datasheet.ciiva.com/16745/pyu-rc0402-51-rohs-l-6-r-16745005.pdf?src-supplier=Future+Electronics
TP3-TP6 = TESTPOINT_PAD: Test Point PCB mount Miniature White
TP7-TP10 = TESTPOINT_THT_MINI: Test Point PCB mount Miniature White; Manufacturer Part Number 1: S1751-46R; Manufacturer: Harwin Inc; Part Description: Natural PC Test Point 0.128" x 0.065" x 0.079" (3.25mm x 1.65mm x 2.00mm) Brass, Tin Plating Surface Mount Mounting Type; Supplier 1: Digi-Key; Supplier Part Number 1: 952-1478-2-ND; RoHS: RoHS Compliant; Color: Natural; Material: Copper Alloy; Mounting Type: Surface Mount; Terminal: 0.128" x 0.065" x 0.079" (3.25mm x 1.65mm x 2.00mm) Brass, Tin Plated; Type: PC Test Point; Packaging: Tape & Reel (TR); Category: Test and Measurement
VD19-VD21 VD23 = DIODE_SCHOTTKY_SOD-523F: Diode Schottky SMD SOD-523F; Manufacturer Part Number 1: SK36A-LTP; Manufacturer: Micro Commercial Co; Part Description: DIODE SCHOTTKY 60V 3A DO214AC; Current - Reverse Leakage @ Vr: 500µA @ 60V; Speed: Fast Recovery =< 500ns, > 200mA (Io); Voltage - DC Reverse (Vr) (Max): 60V; Capacitance @ Vr, F: 250pF @ 4V, 1MHz; Voltage - Forward (Vf) (Max) @ If: 750mV @ 3A; Current - Average Rectified (Io): 3A; Supplier 1: Digi-Key; Supplier Part Number 1: SK36A-LTPMSCT-ND; Package / Case: DO-214AC, SMA; Reverse Recovery Time (trr): -; Diode Type: Schottky; Category: Discrete Semiconductor Products; Mounting Type: Surface Mount; RoHS: RoHS Compliant; Packaging: Cut Tape (CT); Operating Temperature - Junction: -50°C ~ 125°C; Supplier Device Package: DO-214AC (SMA)
VD22 = DIODE_TVS_UNIDIR: SMAJ12CA-13-F; Manufacturer: Taiwan Semiconductor; Part Description: 23.2V Clamp 25.9A Ipp Tvs Diode Surface Mount DO-214AA (SMB); Operating Supply Voltage: 14V; Max Surge Current: 100A; Breakdown Voltage: 15.6V; Number of Channels: 1; Clamping Voltage: 23.2V; Peak Pulse Power: 600W; Polarity: Unidirectional; ComponentLink1URL: http://www.farnell.com/datasheets/2358777.pdf?src-supplier=Farnell; ComponentLink1Description: http://www.farnell.com/datasheets/2358777.pdf?src-supplier=Farnell; ComponentLink2URL: http://www.mouser.com/ds/2/395/SMBJ%20SERIES-231843.pdf?src-supplier=Mouser; ComponentLink2Description: http://www.mouser.com/ds/2/395/SMBJ%20SERIES-231843.pdf?src-supplier=Mouser; ComponentLink3URL: http://www.farnell.com/datasheets/2358777.pdf?src-supplier=Element14; ComponentLink3Description: http://www.farnell.com/datasheets/2358777.pdf?src-supplier=Element14; Supplier 1: Digi-Key; Supplier Part Number 1: SMBJ14AFSCT-ND; Manufacturer Part Number 1: SMBJ14A; Stock 1: 17494; Pricing 1: 1=0,54000, 10=0,46400, 100=0,34630, 500=0,27212, 1000=0,21028 (USD); RoHS: Yes; Case/Package: DO-214AA; Number of Pins: 2; Min Operating Temperature: -65°C; Max Operating Temperature: 150°C; Packaging: Tape and Reel; Package Quantity: 3000; Voltage Rating (DC): 14V; Power Rating: 600W; Length: 5.59mm; Width: 3.94mm; Height: 2.44mm; Lead Free: Lead Free; RoHS Compliant: Yes; Value: SMBJ14A